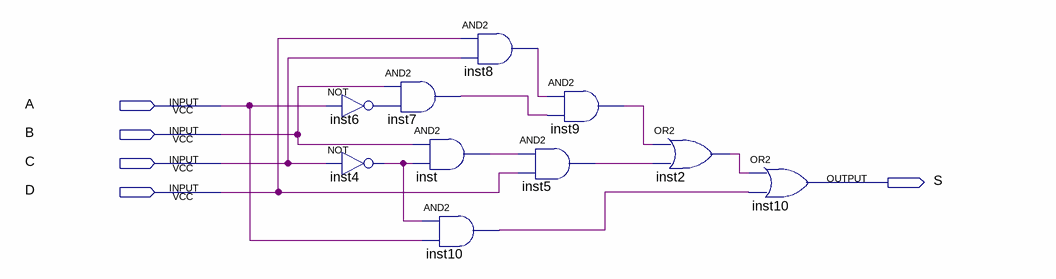
[diagram p0: schematic sheet]
// Quartus schematic misc_4.bdf as structural Verilog: 10 symbols, 5 pins
module misc_4 (
  input  A,
  input  B,
  input  C,
  input  D,
  output S
);

  wire inst2_out, inst4_out, inst5_out, inst6_out, inst7_out, inst8_out, inst9_out, inst10_out, inst_out;

  not inst6 (inst6_out, A);
  not inst4 (inst4_out, C);
  and inst7 (inst7_out, B, inst6_out);
  and inst (inst_out, B, inst4_out);
  and inst10 (inst10_out, inst4_out, A);
  and inst8 (inst8_out, D, C);
  and inst9 (inst9_out, inst8_out, inst7_out);
  and inst5 (inst5_out, inst_out, D);
  or inst2 (inst2_out, inst9_out, inst5_out);
  or inst10_dup2 (S, inst2_out, inst10_out);
endmodule
